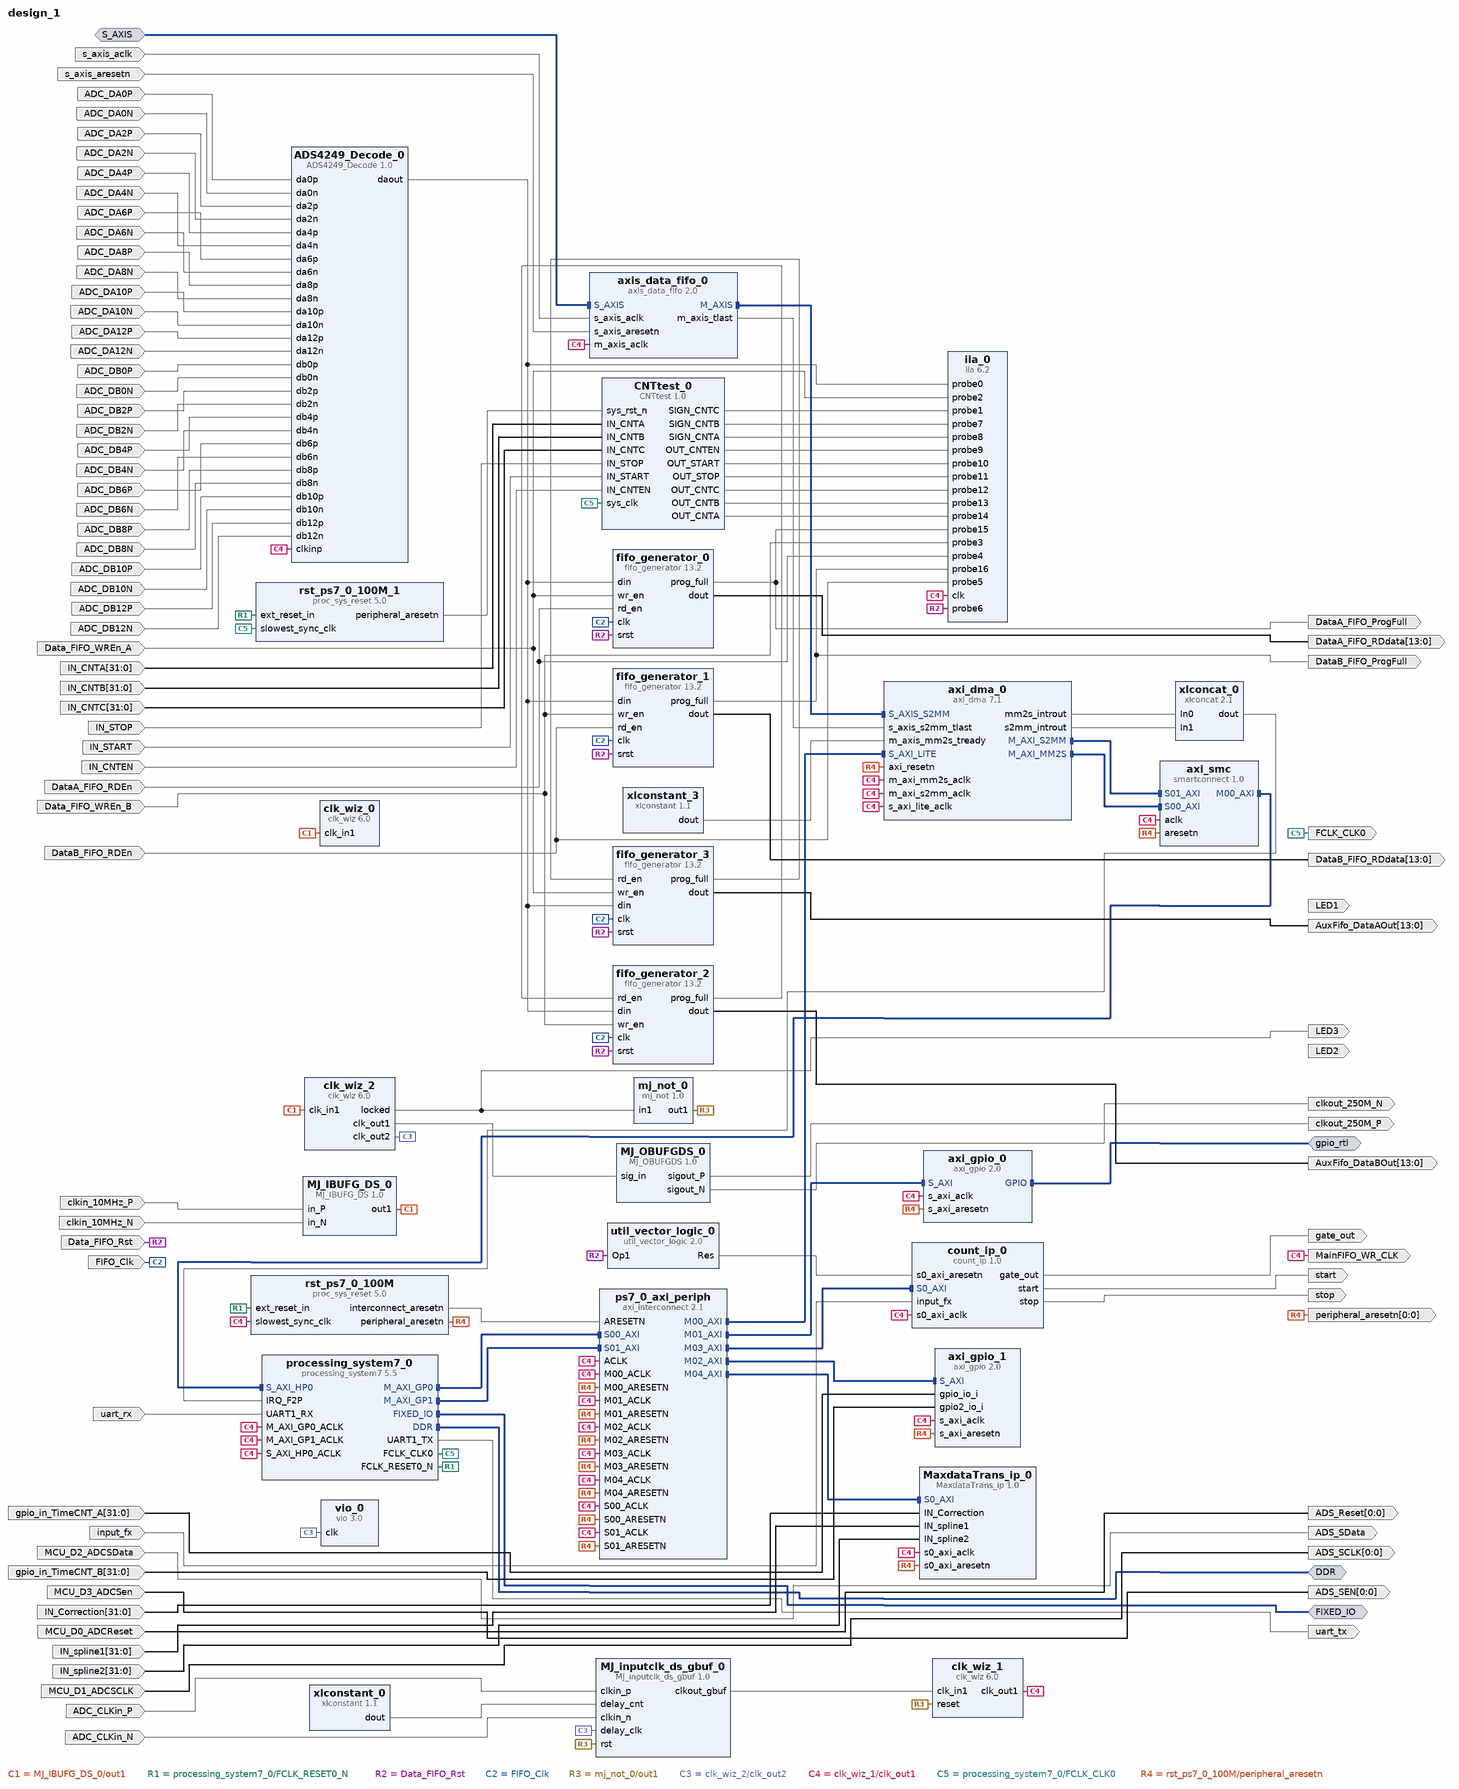
[diagram p0: block diagram of the top level]
# Vivado block design design_1, xc7z030ffg676-2, Vivado 2020.2
create_bd_design design_1

create_bd_intf_port -mode Master -vlnv xilinx.com:interface:ddrx_rtl:1.0 DDR
create_bd_intf_port -mode Master -vlnv xilinx.com:display_processing_system7:fixedio_rtl:1.0 FIXED_IO
create_bd_intf_port -mode Slave -vlnv xilinx.com:interface:axis_rtl:1.0 S_AXIS
set_property -dict [list \
  CONFIG.HAS_TKEEP 1 \
  CONFIG.HAS_TLAST 1 \
  CONFIG.HAS_TREADY 1 \
  CONFIG.HAS_TSTRB 0 \
  CONFIG.LAYERED_METADATA undef \
  CONFIG.TDATA_NUM_BYTES 4 \
  CONFIG.TDEST_WIDTH 0 \
  CONFIG.TID_WIDTH 0 \
  CONFIG.TUSER_WIDTH 0 \
] [get_bd_intf_ports S_AXIS]
create_bd_intf_port -mode Master -vlnv xilinx.com:interface:gpio_rtl:1.0 gpio_rtl
create_bd_port -dir O LED2
create_bd_port -dir O LED1
create_bd_port -dir I MCU_D2_ADCSData
create_bd_port -dir O ADS_SData
create_bd_port -dir O clkout_250M_P
create_bd_port -dir O clkout_250M_N
create_bd_port -dir I -type clk clkin_10MHz_P
set_property -dict {CONFIG.FREQ_HZ 98304000} [get_bd_ports clkin_10MHz_P]
create_bd_port -dir I -type clk clkin_10MHz_N
set_property -dict {CONFIG.FREQ_HZ 98304000} [get_bd_ports clkin_10MHz_N]
create_bd_port -dir I ADC_DA0P
create_bd_port -dir I ADC_DA0N
create_bd_port -dir I ADC_DA2P
create_bd_port -dir I ADC_DA2N
create_bd_port -dir I ADC_DA4P
create_bd_port -dir I ADC_DA4N
create_bd_port -dir I ADC_DA6P
create_bd_port -dir I ADC_DA6N
create_bd_port -dir I ADC_DA8P
create_bd_port -dir I ADC_DA8N
create_bd_port -dir I ADC_DA10P
create_bd_port -dir I ADC_DA10N
create_bd_port -dir I ADC_DA12P
create_bd_port -dir I ADC_DA12N
create_bd_port -dir I ADC_DB0P
create_bd_port -dir I ADC_DB0N
create_bd_port -dir I ADC_DB2P
create_bd_port -dir I ADC_DB2N
create_bd_port -dir I ADC_DB4P
create_bd_port -dir I ADC_DB4N
create_bd_port -dir I ADC_DB6P
create_bd_port -dir I ADC_DB6N
create_bd_port -dir I ADC_DB8P
create_bd_port -dir I ADC_DB8N
create_bd_port -dir I ADC_DB10P
create_bd_port -dir I ADC_DB10N
create_bd_port -dir I ADC_DB12P
create_bd_port -dir I ADC_DB12N
create_bd_port -dir I MCU_D3_ADCSen
create_bd_port -dir O -from 0 -to 0 ADS_SEN
create_bd_port -dir I MCU_D0_ADCReset
create_bd_port -dir O -from 0 -to 0 ADS_Reset
create_bd_port -dir I MCU_D1_ADCSCLK
create_bd_port -dir O -from 0 -to 0 ADS_SCLK
create_bd_port -dir O uart_tx
create_bd_port -dir I -type clk s_axis_aclk
create_bd_port -dir I -type rst s_axis_aresetn
create_bd_port -dir I uart_rx
create_bd_port -dir O LED3
create_bd_port -dir O -from 13 -to 0 DataA_FIFO_RDdata
create_bd_port -dir I -type rst Data_FIFO_Rst
set_property -dict {CONFIG.POLARITY ACTIVE_HIGH} [get_bd_ports Data_FIFO_Rst]
create_bd_port -dir I Data_FIFO_WREn_A
create_bd_port -dir O -from 13 -to 0 DataB_FIFO_RDdata
create_bd_port -dir O -from 13 -to 0 -type data AuxFifo_DataBOut
create_bd_port -dir O -from 13 -to 0 -type data AuxFifo_DataAOut
create_bd_port -dir I -from 31 -to 0 -type data gpio_in_TimeCNT_A
create_bd_port -dir I -from 31 -to 0 -type data gpio_in_TimeCNT_B
create_bd_port -dir I Data_FIFO_WREn_B
create_bd_port -dir I -type clk FIFO_Clk
set_property -dict {CONFIG.FREQ_HZ 250000000} [get_bd_ports FIFO_Clk]
create_bd_port -dir O DataA_FIFO_ProgFull
create_bd_port -dir I ADC_CLKin_P
create_bd_port -dir I ADC_CLKin_N
create_bd_port -dir O -type clk MainFIFO_WR_CLK
create_bd_port -dir I DataA_FIFO_RDEn
create_bd_port -dir O DataB_FIFO_ProgFull
create_bd_port -dir I DataB_FIFO_RDEn
create_bd_port -dir O -type clk FCLK_CLK0
create_bd_port -dir I input_fx
create_bd_port -dir O gate_out
create_bd_port -dir O stop
create_bd_port -dir O start
create_bd_port -dir O -from 0 -to 0 -type rst peripheral_aresetn
create_bd_port -dir I -from 31 -to 0 IN_CNTA
create_bd_port -dir I -from 31 -to 0 IN_CNTB
create_bd_port -dir I -from 31 -to 0 IN_CNTC
create_bd_port -dir I IN_STOP
create_bd_port -dir I IN_START
create_bd_port -dir I IN_CNTEN
create_bd_port -dir I -from 31 -to 0 IN_Correction
create_bd_port -dir I -from 31 -to 0 IN_spline1
create_bd_port -dir I -from 31 -to 0 IN_spline2

create_bd_cell -type ip -vlnv xilinx.com:user:MJ_OBUFGDS:1.0 MJ_OBUFGDS_0
create_bd_cell -type ip -vlnv xilinx.com:user:MJ_IBUFG_DS:1.0 MJ_IBUFG_DS_0
create_bd_cell -type ip -vlnv xilinx.com:user:ADS4249_Decode:1.0 ADS4249_Decode_0
create_bd_cell -type ip -vlnv xilinx.com:ip:processing_system7:5.5 processing_system7_0
set_property -dict [list \
  CONFIG.PCW_APU_PERIPHERAL_FREQMHZ 666.666666 \
  CONFIG.PCW_CPU_CPU_6X4X_MAX_RANGE 800 \
  CONFIG.PCW_ENET0_ENET0_IO {MIO 16 .. 27} \
  CONFIG.PCW_ENET0_GRP_MDIO_ENABLE 1 \
  CONFIG.PCW_ENET0_GRP_MDIO_IO {MIO 52 .. 53} \
  CONFIG.PCW_ENET0_PERIPHERAL_ENABLE 1 \
  CONFIG.PCW_FPGA0_PERIPHERAL_FREQMHZ 100 \
  CONFIG.PCW_FPGA1_PERIPHERAL_FREQMHZ 50 \
  CONFIG.PCW_GPIO_MIO_GPIO_ENABLE 0 \
  CONFIG.PCW_IRQ_F2P_INTR 1 \
  CONFIG.PCW_PERIPHERAL_BOARD_PRESET None \
  CONFIG.PCW_PRESET_BANK1_VOLTAGE {LVCMOS 1.8V} \
  CONFIG.PCW_QSPI_GRP_FBCLK_ENABLE 1 \
  CONFIG.PCW_QSPI_GRP_FBCLK_IO {MIO 8} \
  CONFIG.PCW_QSPI_GRP_SINGLE_SS_ENABLE 1 \
  CONFIG.PCW_QSPI_GRP_SINGLE_SS_IO {MIO 1 .. 6} \
  CONFIG.PCW_QSPI_PERIPHERAL_ENABLE 1 \
  CONFIG.PCW_QSPI_PERIPHERAL_FREQMHZ 125 \
  CONFIG.PCW_QSPI_QSPI_IO {MIO 1 .. 6} \
  CONFIG.PCW_SD0_GRP_CD_ENABLE 1 \
  CONFIG.PCW_SD0_GRP_CD_IO {MIO 47} \
  CONFIG.PCW_SD0_GRP_WP_ENABLE 0 \
  CONFIG.PCW_SD0_PERIPHERAL_ENABLE 1 \
  CONFIG.PCW_SD0_SD0_IO {MIO 40 .. 45} \
  CONFIG.PCW_SDIO_PERIPHERAL_FREQMHZ 100 \
  CONFIG.PCW_SINGLE_QSPI_DATA_MODE x4 \
  CONFIG.PCW_UART1_PERIPHERAL_ENABLE 1 \
  CONFIG.PCW_UART1_UART1_IO EMIO \
  CONFIG.PCW_UART_PERIPHERAL_FREQMHZ 100 \
  CONFIG.PCW_UIPARAM_DDR_FREQ_MHZ 533.333333 \
  CONFIG.PCW_UIPARAM_DDR_PARTNO {MT41K256M16 RE-125} \
  CONFIG.PCW_USB0_PERIPHERAL_ENABLE 0 \
  CONFIG.PCW_USE_FABRIC_INTERRUPT 1 \
  CONFIG.PCW_USE_M_AXI_GP1 1 \
  CONFIG.PCW_USE_S_AXI_HP0 1 \
] [get_bd_cells processing_system7_0]
# 431 more settings of processing_system7_0 are not shown: defaults, MIO pin electricals, DDR timing, and values the tool derives
create_bd_cell -type ip -vlnv xilinx.com:user:MJ_inputclk_ds_gbuf:1.0 MJ_inputclk_ds_gbuf_0
create_bd_cell -type ip -vlnv xilinx.com:user:mj_not:1.0 mj_not_0
create_bd_cell -type ip -vlnv xilinx.com:user:CNTtest:1.0 CNTtest_0
create_bd_cell -type ip -vlnv xilinx.com:user:count_ip:1.0 count_ip_0
create_bd_cell -type ip -vlnv xilinx.com:user:MaxdataTrans_ip:1.0 MaxdataTrans_ip_0
create_bd_cell -type ip -vlnv xilinx.com:ip:axi_dma:7.1 axi_dma_0
set_property -dict {CONFIG.c_include_sg 0 CONFIG.c_sg_length_width 23} [get_bd_cells axi_dma_0]
create_bd_cell -type ip -vlnv xilinx.com:ip:axi_gpio:2.0 axi_gpio_0
set_property -dict {CONFIG.C_ALL_OUTPUTS 0 CONFIG.C_GPIO_WIDTH 8} [get_bd_cells axi_gpio_0]
create_bd_cell -type ip -vlnv xilinx.com:ip:axi_gpio:2.0 axi_gpio_1
set_property -dict [list \
  CONFIG.C_ALL_INPUTS 1 \
  CONFIG.C_ALL_INPUTS_2 1 \
  CONFIG.C_GPIO_WIDTH 32 \
  CONFIG.C_IS_DUAL 1 \
] [get_bd_cells axi_gpio_1]
create_bd_cell -type ip -vlnv xilinx.com:ip:smartconnect:1.0 axi_smc
set_property -dict {CONFIG.NUM_SI 2} [get_bd_cells axi_smc]
create_bd_cell -type ip -vlnv xilinx.com:ip:axis_data_fifo:2.0 axis_data_fifo_0
set_property -dict [list \
  CONFIG.FIFO_DEPTH 1024 \
  CONFIG.HAS_RD_DATA_COUNT 1 \
  CONFIG.HAS_WR_DATA_COUNT 1 \
  CONFIG.IS_ACLK_ASYNC 1 \
  CONFIG.SYNCHRONIZATION_STAGES 2 \
] [get_bd_cells axis_data_fifo_0]
create_bd_cell -type ip -vlnv xilinx.com:ip:clk_wiz:6.0 clk_wiz_0
set_property -dict [list \
  CONFIG.CLKIN1_JITTER_PS 10 \
  CONFIG.CLKIN1_UI_JITTER 10 \
  CONFIG.CLKIN2_JITTER_PS 100.000 \
  CONFIG.CLKIN2_UI_JITTER 100.000 \
  CONFIG.CLKOUT1_DRIVES BUFG \
  CONFIG.CLKOUT1_JITTER 118.932 \
  CONFIG.CLKOUT1_PHASE_ERROR 230.564 \
  CONFIG.CLKOUT1_REQUESTED_OUT_FREQ 250 \
  CONFIG.CLKOUT2_DRIVES BUFG \
  CONFIG.CLKOUT2_JITTER 148.965 \
  CONFIG.CLKOUT2_PHASE_ERROR 230.564 \
  CONFIG.CLKOUT2_REQUESTED_OUT_FREQ 50 \
  CONFIG.CLKOUT2_USED true \
  CONFIG.CLKOUT3_DRIVES BUFG \
  CONFIG.CLKOUT3_REQUESTED_OUT_FREQ 100.000 \
  CONFIG.CLKOUT4_DRIVES BUFG \
  CONFIG.CLKOUT4_REQUESTED_OUT_FREQ 100.000 \
  CONFIG.CLKOUT5_DRIVES BUFG \
  CONFIG.CLKOUT5_REQUESTED_OUT_FREQ 100.000 \
  CONFIG.CLKOUT6_DRIVES BUFG \
  CONFIG.CLKOUT6_REQUESTED_OUT_FREQ 100.000 \
  CONFIG.CLKOUT7_DRIVES BUFG \
  CONFIG.CLKOUT7_REQUESTED_OUT_FREQ 100.000 \
  CONFIG.FEEDBACK_SOURCE FDBK_AUTO \
  CONFIG.JITTER_OPTIONS PS \
  CONFIG.JITTER_SEL Min_O_Jitter \
  CONFIG.MMCM_BANDWIDTH HIGH \
  CONFIG.MMCM_CLKFBOUT_MULT_F 61 \
  CONFIG.MMCM_CLKIN1_PERIOD 10.172 \
  CONFIG.MMCM_CLKIN2_PERIOD 10.000 \
  CONFIG.MMCM_CLKOUT0_DIVIDE_F 6 \
  CONFIG.MMCM_CLKOUT1_DIVIDE 30 \
  CONFIG.MMCM_COMPENSATION ZHOLD \
  CONFIG.MMCM_DIVCLK_DIVIDE 4 \
  CONFIG.MMCM_REF_JITTER1 0.001 \
  CONFIG.MMCM_REF_JITTER2 0.010 \
  CONFIG.NUM_OUT_CLKS 2 \
  CONFIG.OVERRIDE_MMCM false \
  CONFIG.PRIMITIVE PLL \
  CONFIG.PRIM_IN_FREQ 98.304 \
  CONFIG.PRIM_SOURCE Global_buffer \
  CONFIG.USE_CLOCK_SEQUENCING false \
  CONFIG.USE_FREQ_SYNTH true \
  CONFIG.USE_RESET false \
  CONFIG.USE_SAFE_CLOCK_STARTUP false \
] [get_bd_cells clk_wiz_0]
create_bd_cell -type ip -vlnv xilinx.com:ip:clk_wiz:6.0 clk_wiz_2
set_property -dict [list \
  CONFIG.CLKIN1_JITTER_PS 10 \
  CONFIG.CLKIN1_UI_JITTER 10 \
  CONFIG.CLKIN2_JITTER_PS 100.000 \
  CONFIG.CLKIN2_UI_JITTER 100.000 \
  CONFIG.CLKOUT1_DRIVES BUFG \
  CONFIG.CLKOUT1_JITTER 73.135 \
  CONFIG.CLKOUT1_PHASE_ERROR 65.553 \
  CONFIG.CLKOUT1_REQUESTED_OUT_FREQ 200 \
  CONFIG.CLKOUT2_DRIVES BUFG \
  CONFIG.CLKOUT2_JITTER 95.295 \
  CONFIG.CLKOUT2_PHASE_ERROR 65.553 \
  CONFIG.CLKOUT2_REQUESTED_OUT_FREQ 50 \
  CONFIG.CLKOUT2_USED true \
  CONFIG.CLKOUT3_DRIVES BUFG \
  CONFIG.CLKOUT3_REQUESTED_OUT_FREQ 100.000 \
  CONFIG.CLKOUT4_DRIVES BUFG \
  CONFIG.CLKOUT4_REQUESTED_OUT_FREQ 100.000 \
  CONFIG.CLKOUT5_DRIVES BUFG \
  CONFIG.CLKOUT5_REQUESTED_OUT_FREQ 100.000 \
  CONFIG.CLKOUT6_DRIVES BUFG \
  CONFIG.CLKOUT6_REQUESTED_OUT_FREQ 100.000 \
  CONFIG.CLKOUT7_DRIVES BUFG \
  CONFIG.CLKOUT7_REQUESTED_OUT_FREQ 100.000 \
  CONFIG.FEEDBACK_SOURCE FDBK_AUTO \
  CONFIG.JITTER_OPTIONS PS \
  CONFIG.JITTER_SEL Min_O_Jitter \
  CONFIG.MMCM_BANDWIDTH HIGH \
  CONFIG.MMCM_CLKFBOUT_MULT_F 9 \
  CONFIG.MMCM_CLKIN1_PERIOD 5.000 \
  CONFIG.MMCM_CLKIN2_PERIOD 10.000 \
  CONFIG.MMCM_CLKOUT0_DIVIDE_F 9 \
  CONFIG.MMCM_CLKOUT1_DIVIDE 36 \
  CONFIG.MMCM_COMPENSATION ZHOLD \
  CONFIG.MMCM_DIVCLK_DIVIDE 1 \
  CONFIG.MMCM_REF_JITTER1 0.002 \
  CONFIG.MMCM_REF_JITTER2 0.010 \
  CONFIG.NUM_OUT_CLKS 2 \
  CONFIG.OVERRIDE_MMCM false \
  CONFIG.PRIMITIVE PLL \
  CONFIG.PRIM_IN_FREQ 200 \
  CONFIG.PRIM_SOURCE Global_buffer \
  CONFIG.USE_CLOCK_SEQUENCING false \
  CONFIG.USE_FREQ_SYNTH true \
  CONFIG.USE_RESET true \
  CONFIG.USE_SAFE_CLOCK_STARTUP false \
] [get_bd_cells clk_wiz_2]
create_bd_cell -type ip -vlnv xilinx.com:ip:clk_wiz:6.0 clk_wiz_1
set_property -dict [list \
  CONFIG.CLKIN1_JITTER_PS 400.0 \
  CONFIG.CLKIN1_UI_JITTER 0.10 \
  CONFIG.CLKOUT1_DRIVES BUFG \
  CONFIG.CLKOUT1_JITTER 100.428 \
  CONFIG.CLKOUT1_PHASE_ERROR 66.982 \
  CONFIG.CLKOUT1_REQUESTED_OUT_FREQ 250 \
  CONFIG.CLKOUT2_DRIVES BUFG \
  CONFIG.CLKOUT3_DRIVES BUFG \
  CONFIG.CLKOUT4_DRIVES BUFG \
  CONFIG.CLKOUT5_DRIVES BUFG \
  CONFIG.CLKOUT6_DRIVES BUFG \
  CONFIG.CLKOUT7_DRIVES BUFG \
  CONFIG.JITTER_SEL Min_O_Jitter \
  CONFIG.MMCM_BANDWIDTH HIGH \
  CONFIG.MMCM_CLKFBOUT_MULT_F 7 \
  CONFIG.MMCM_CLKIN1_PERIOD 4.000 \
  CONFIG.MMCM_CLKIN2_PERIOD 10.0 \
  CONFIG.MMCM_CLKOUT0_DIVIDE_F 7 \
  CONFIG.MMCM_COMPENSATION ZHOLD \
  CONFIG.MMCM_DIVCLK_DIVIDE 1 \
  CONFIG.MMCM_REF_JITTER1 0.100 \
  CONFIG.PRIMITIVE PLL \
  CONFIG.PRIM_IN_FREQ 250 \
  CONFIG.PRIM_SOURCE No_buffer \
  CONFIG.USE_LOCKED false \
] [get_bd_cells clk_wiz_1]
create_bd_cell -type ip -vlnv xilinx.com:ip:fifo_generator:13.2 fifo_generator_0
set_property -dict [list \
  CONFIG.Data_Count false \
  CONFIG.Fifo_Implementation Common_Clock_Block_RAM \
  CONFIG.Full_Threshold_Assert_Value 1022 \
  CONFIG.Input_Data_Width 14 \
  CONFIG.Input_Depth 1024 \
  CONFIG.Output_Data_Width 14 \
  CONFIG.Programmable_Full_Type Single_Programmable_Full_Threshold_Constant \
  CONFIG.Reset_Type Synchronous_Reset \
  CONFIG.Use_Dout_Reset true \
] [get_bd_cells fifo_generator_0]
create_bd_cell -type ip -vlnv xilinx.com:ip:fifo_generator:13.2 fifo_generator_1
set_property -dict [list \
  CONFIG.Data_Count false \
  CONFIG.Fifo_Implementation Common_Clock_Block_RAM \
  CONFIG.Full_Threshold_Assert_Value 1022 \
  CONFIG.Input_Data_Width 14 \
  CONFIG.Input_Depth 1024 \
  CONFIG.Output_Data_Width 14 \
  CONFIG.Programmable_Full_Type Single_Programmable_Full_Threshold_Constant \
  CONFIG.Reset_Type Synchronous_Reset \
  CONFIG.Use_Dout_Reset true \
] [get_bd_cells fifo_generator_1]
create_bd_cell -type ip -vlnv xilinx.com:ip:fifo_generator:13.2 fifo_generator_2
set_property -dict [list \
  CONFIG.Almost_Full_Flag false \
  CONFIG.Full_Threshold_Assert_Value 254 \
  CONFIG.Input_Data_Width 14 \
  CONFIG.Input_Depth 256 \
  CONFIG.Output_Data_Width 14 \
  CONFIG.Programmable_Empty_Type No_Programmable_Empty_Threshold \
  CONFIG.Programmable_Full_Type Single_Programmable_Full_Threshold_Constant \
] [get_bd_cells fifo_generator_2]
create_bd_cell -type ip -vlnv xilinx.com:ip:fifo_generator:13.2 fifo_generator_3
set_property -dict [list \
  CONFIG.Full_Threshold_Assert_Value 254 \
  CONFIG.Input_Data_Width 14 \
  CONFIG.Input_Depth 256 \
  CONFIG.Output_Data_Width 14 \
  CONFIG.Programmable_Empty_Type No_Programmable_Empty_Threshold \
  CONFIG.Programmable_Full_Type Single_Programmable_Full_Threshold_Constant \
] [get_bd_cells fifo_generator_3]
create_bd_cell -type ip -vlnv xilinx.com:ip:ila:6.2 ila_0
set_property -dict [list \
  CONFIG.C_DATA_DEPTH 8192 \
  CONFIG.C_ENABLE_ILA_AXI_MON false \
  CONFIG.C_MONITOR_TYPE Native \
  CONFIG.C_NUM_OF_PROBES 17 \
  CONFIG.C_PROBE0_WIDTH 14 \
  CONFIG.C_PROBE12_WIDTH 32 \
  CONFIG.C_PROBE13_WIDTH 32 \
  CONFIG.C_PROBE14_WIDTH 32 \
  CONFIG.C_PROBE1_WIDTH 1 \
] [get_bd_cells ila_0]
create_bd_cell -type ip -vlnv xilinx.com:ip:axi_interconnect:2.1 ps7_0_axi_periph
set_property -dict [list \
  CONFIG.NUM_MI 5 \
  CONFIG.NUM_SI 2 \
  CONFIG.S00_HAS_DATA_FIFO 2 \
  CONFIG.S01_HAS_DATA_FIFO 2 \
  CONFIG.STRATEGY 2 \
] [get_bd_cells ps7_0_axi_periph]
create_bd_cell -type ip -vlnv xilinx.com:ip:proc_sys_reset:5.0 rst_ps7_0_100M
create_bd_cell -type ip -vlnv xilinx.com:ip:proc_sys_reset:5.0 rst_ps7_0_100M_1
create_bd_cell -type ip -vlnv xilinx.com:ip:util_vector_logic:2.0 util_vector_logic_0
set_property -dict {CONFIG.C_OPERATION not CONFIG.C_SIZE 1} [get_bd_cells util_vector_logic_0]
create_bd_cell -type ip -vlnv xilinx.com:ip:vio:3.0 vio_0
set_property -dict {CONFIG.C_NUM_PROBE_IN 0 CONFIG.C_PROBE_OUT0_INIT_VAL 0x03 CONFIG.C_PROBE_OUT0_WIDTH 5} [get_bd_cells vio_0]
create_bd_cell -type ip -vlnv xilinx.com:ip:xlconcat:2.1 xlconcat_0
create_bd_cell -type ip -vlnv xilinx.com:ip:xlconstant:1.1 xlconstant_0
set_property -dict {CONFIG.CONST_VAL 3 CONFIG.CONST_WIDTH 5} [get_bd_cells xlconstant_0]
create_bd_cell -type ip -vlnv xilinx.com:ip:xlconstant:1.1 xlconstant_3

# ---- connections ----

connect_bd_intf_net [get_bd_intf_pins axi_smc/M00_AXI] [get_bd_intf_pins processing_system7_0/S_AXI_HP0]
connect_bd_intf_net [get_bd_intf_pins axi_dma_0/M_AXI_S2MM] [get_bd_intf_pins axi_smc/S01_AXI]
connect_bd_intf_net [get_bd_intf_pins axis_data_fifo_0/M_AXIS] [get_bd_intf_pins axi_dma_0/S_AXIS_S2MM]
connect_bd_intf_net [get_bd_intf_pins processing_system7_0/M_AXI_GP0] [get_bd_intf_pins ps7_0_axi_periph/S00_AXI]
connect_bd_intf_net [get_bd_intf_pins axi_dma_0/M_AXI_MM2S] [get_bd_intf_pins axi_smc/S00_AXI]
connect_bd_intf_net [get_bd_intf_pins ps7_0_axi_periph/M01_AXI] [get_bd_intf_pins axi_gpio_0/S_AXI]
connect_bd_intf_net [get_bd_intf_pins ps7_0_axi_periph/M02_AXI] [get_bd_intf_pins axi_gpio_1/S_AXI]
connect_bd_intf_net [get_bd_intf_pins ps7_0_axi_periph/M00_AXI] [get_bd_intf_pins axi_dma_0/S_AXI_LITE]
connect_bd_intf_net [get_bd_intf_pins processing_system7_0/M_AXI_GP1] [get_bd_intf_pins ps7_0_axi_periph/S01_AXI]
connect_bd_intf_net [get_bd_intf_pins ps7_0_axi_periph/M03_AXI] [get_bd_intf_pins count_ip_0/S0_AXI]
connect_bd_intf_net [get_bd_intf_pins ps7_0_axi_periph/M04_AXI] [get_bd_intf_pins MaxdataTrans_ip_0/S0_AXI]
connect_bd_intf_net [get_bd_intf_ports FIXED_IO] [get_bd_intf_pins processing_system7_0/FIXED_IO]
connect_bd_intf_net -intf_net S_AXIS_0_1 [get_bd_intf_ports S_AXIS] [get_bd_intf_pins axis_data_fifo_0/S_AXIS]
connect_bd_intf_net [get_bd_intf_ports DDR] [get_bd_intf_pins processing_system7_0/DDR]
connect_bd_intf_net [get_bd_intf_ports gpio_rtl] [get_bd_intf_pins axi_gpio_0/GPIO]
connect_bd_net [get_bd_ports MCU_D2_ADCSData] [get_bd_ports ADS_SData]
connect_bd_net [get_bd_pins MJ_IBUFG_DS_0/out1] [get_bd_pins clk_wiz_0/clk_in1] [get_bd_pins clk_wiz_2/clk_in1]
connect_bd_net [get_bd_pins MJ_OBUFGDS_0/sigout_P] [get_bd_ports clkout_250M_P]
connect_bd_net [get_bd_pins MJ_OBUFGDS_0/sigout_N] [get_bd_ports clkout_250M_N]
connect_bd_net [get_bd_ports clkin_10MHz_P] [get_bd_pins MJ_IBUFG_DS_0/in_P]
connect_bd_net [get_bd_ports clkin_10MHz_N] [get_bd_pins MJ_IBUFG_DS_0/in_N]
connect_bd_net [get_bd_ports ADC_DA0P] [get_bd_pins ADS4249_Decode_0/da0p]
connect_bd_net [get_bd_ports ADC_DA0N] [get_bd_pins ADS4249_Decode_0/da0n]
connect_bd_net [get_bd_ports ADC_DA2P] [get_bd_pins ADS4249_Decode_0/da2p]
connect_bd_net [get_bd_ports ADC_DA2N] [get_bd_pins ADS4249_Decode_0/da2n]
connect_bd_net [get_bd_ports ADC_DA4P] [get_bd_pins ADS4249_Decode_0/da4p]
connect_bd_net [get_bd_ports ADC_DA4N] [get_bd_pins ADS4249_Decode_0/da4n]
connect_bd_net [get_bd_ports ADC_DA6P] [get_bd_pins ADS4249_Decode_0/da6p]
connect_bd_net [get_bd_ports ADC_DA6N] [get_bd_pins ADS4249_Decode_0/da6n]
connect_bd_net [get_bd_ports ADC_DA8P] [get_bd_pins ADS4249_Decode_0/da8p]
connect_bd_net [get_bd_ports ADC_DA8N] [get_bd_pins ADS4249_Decode_0/da8n]
connect_bd_net [get_bd_ports ADC_DA10P] [get_bd_pins ADS4249_Decode_0/da10p]
connect_bd_net [get_bd_ports ADC_DA10N] [get_bd_pins ADS4249_Decode_0/da10n]
connect_bd_net [get_bd_ports ADC_DA12P] [get_bd_pins ADS4249_Decode_0/da12p]
connect_bd_net [get_bd_ports ADC_DA12N] [get_bd_pins ADS4249_Decode_0/da12n]
connect_bd_net [get_bd_ports ADC_DB0P] [get_bd_pins ADS4249_Decode_0/db0p]
connect_bd_net [get_bd_ports ADC_DB0N] [get_bd_pins ADS4249_Decode_0/db0n]
connect_bd_net [get_bd_ports ADC_DB2P] [get_bd_pins ADS4249_Decode_0/db2p]
connect_bd_net [get_bd_ports ADC_DB2N] [get_bd_pins ADS4249_Decode_0/db2n]
connect_bd_net [get_bd_ports ADC_DB4P] [get_bd_pins ADS4249_Decode_0/db4p]
connect_bd_net [get_bd_ports ADC_DB4N] [get_bd_pins ADS4249_Decode_0/db4n]
connect_bd_net [get_bd_ports ADC_DB6P] [get_bd_pins ADS4249_Decode_0/db6p]
connect_bd_net [get_bd_ports ADC_DB6N] [get_bd_pins ADS4249_Decode_0/db6n]
connect_bd_net [get_bd_ports ADC_DB8P] [get_bd_pins ADS4249_Decode_0/db8p]
connect_bd_net [get_bd_ports ADC_DB8N] [get_bd_pins ADS4249_Decode_0/db8n]
connect_bd_net [get_bd_ports ADC_DB10P] [get_bd_pins ADS4249_Decode_0/db10p]
connect_bd_net [get_bd_ports ADC_DB10N] [get_bd_pins ADS4249_Decode_0/db10n]
connect_bd_net [get_bd_ports ADC_DB12P] [get_bd_pins ADS4249_Decode_0/db12p]
connect_bd_net [get_bd_ports ADC_DB12N] [get_bd_pins ADS4249_Decode_0/db12n]
connect_bd_net -net ADS4249_Decode_0_daout [get_bd_pins ADS4249_Decode_0/daout] \
  [get_bd_pins fifo_generator_0/din] [get_bd_pins fifo_generator_1/din] [get_bd_pins fifo_generator_2/din] \
  [get_bd_pins fifo_generator_3/din] [get_bd_pins ila_0/probe0]
connect_bd_net [get_bd_ports MCU_D3_ADCSen] [get_bd_ports ADS_SEN]
connect_bd_net [get_bd_ports MCU_D0_ADCReset] [get_bd_ports ADS_Reset]
connect_bd_net [get_bd_ports MCU_D1_ADCSCLK] [get_bd_ports ADS_SCLK]
connect_bd_net [get_bd_pins axi_dma_0/mm2s_introut] [get_bd_pins xlconcat_0/In0]
connect_bd_net [get_bd_pins axi_dma_0/s2mm_introut] [get_bd_pins xlconcat_0/In1]
connect_bd_net [get_bd_pins axis_data_fifo_0/m_axis_tlast] [get_bd_pins axi_dma_0/s_axis_s2mm_tlast]
connect_bd_net [get_bd_pins processing_system7_0/FCLK_RESET0_N] [get_bd_pins rst_ps7_0_100M/ext_reset_in] [get_bd_pins rst_ps7_0_100M_1/ext_reset_in]
connect_bd_net [get_bd_pins processing_system7_0/UART1_TX] [get_bd_ports uart_tx]
connect_bd_net [get_bd_pins rst_ps7_0_100M/interconnect_aresetn] [get_bd_pins ps7_0_axi_periph/ARESETN]
connect_bd_net -net s_axis_aclk_0_1 [get_bd_ports s_axis_aclk] [get_bd_pins axis_data_fifo_0/s_axis_aclk]
connect_bd_net -net s_axis_aresetn_0_1 [get_bd_ports s_axis_aresetn] [get_bd_pins axis_data_fifo_0/s_axis_aresetn]
connect_bd_net [get_bd_ports uart_rx] [get_bd_pins processing_system7_0/UART1_RX]
connect_bd_net [get_bd_pins xlconcat_0/dout] [get_bd_pins processing_system7_0/IRQ_F2P]
connect_bd_net -net xlconstant_0_dout [get_bd_pins xlconstant_3/dout] [get_bd_pins axi_dma_0/m_axis_mm2s_tready]
connect_bd_net -net clk_wiz_0_locked [get_bd_pins clk_wiz_2/locked] [get_bd_ports LED3] [get_bd_pins mj_not_0/in1]
connect_bd_net [get_bd_pins fifo_generator_0/dout] [get_bd_ports DataA_FIFO_RDdata]
connect_bd_net [get_bd_ports Data_FIFO_Rst] \
  [get_bd_pins fifo_generator_0/srst] [get_bd_pins fifo_generator_1/srst] [get_bd_pins fifo_generator_2/srst] \
  [get_bd_pins fifo_generator_3/srst] [get_bd_pins ila_0/probe6] [get_bd_pins util_vector_logic_0/Op1]
connect_bd_net -net Data_FIFO_WREn_1 [get_bd_ports Data_FIFO_WREn_A] \
  [get_bd_pins fifo_generator_0/wr_en] [get_bd_pins fifo_generator_3/wr_en] [get_bd_pins ila_0/probe2]
connect_bd_net [get_bd_pins fifo_generator_1/dout] [get_bd_ports DataB_FIFO_RDdata]
connect_bd_net [get_bd_pins fifo_generator_2/dout] [get_bd_ports AuxFifo_DataBOut]
connect_bd_net [get_bd_pins fifo_generator_3/dout] [get_bd_ports AuxFifo_DataAOut]
connect_bd_net [get_bd_ports gpio_in_TimeCNT_A] [get_bd_pins axi_gpio_1/gpio_io_i]
connect_bd_net [get_bd_ports gpio_in_TimeCNT_B] [get_bd_pins axi_gpio_1/gpio2_io_i]
connect_bd_net [get_bd_ports Data_FIFO_WREn_B] [get_bd_pins fifo_generator_1/wr_en] [get_bd_pins fifo_generator_2/wr_en] [get_bd_pins ila_0/probe3]
connect_bd_net [get_bd_ports FIFO_Clk] \
  [get_bd_pins fifo_generator_0/clk] [get_bd_pins fifo_generator_1/clk] [get_bd_pins fifo_generator_2/clk] \
  [get_bd_pins fifo_generator_3/clk]
connect_bd_net [get_bd_pins fifo_generator_2/prog_full] [get_bd_pins fifo_generator_2/rd_en]
connect_bd_net [get_bd_pins fifo_generator_3/prog_full] [get_bd_pins fifo_generator_3/rd_en]
connect_bd_net [get_bd_pins fifo_generator_0/prog_full] [get_bd_ports DataA_FIFO_ProgFull] [get_bd_pins ila_0/probe15]
connect_bd_net [get_bd_ports ADC_CLKin_P] [get_bd_pins MJ_inputclk_ds_gbuf_0/clkin_p]
connect_bd_net [get_bd_ports ADC_CLKin_N] [get_bd_pins MJ_inputclk_ds_gbuf_0/clkin_n]
connect_bd_net [get_bd_pins mj_not_0/out1] [get_bd_pins MJ_inputclk_ds_gbuf_0/rst] [get_bd_pins clk_wiz_1/reset]
connect_bd_net -net clk_wiz_0_clk_out2 [get_bd_pins clk_wiz_2/clk_out2] [get_bd_pins MJ_inputclk_ds_gbuf_0/delay_clk] [get_bd_pins vio_0/clk]
connect_bd_net [get_bd_pins MJ_inputclk_ds_gbuf_0/clkout_gbuf] [get_bd_pins clk_wiz_1/clk_in1]
connect_bd_net [get_bd_pins clk_wiz_1/clk_out1] \
  [get_bd_ports MainFIFO_WR_CLK] [get_bd_pins ADS4249_Decode_0/clkinp] [get_bd_pins processing_system7_0/M_AXI_GP0_ACLK] \
  [get_bd_pins processing_system7_0/S_AXI_HP0_ACLK] [get_bd_pins processing_system7_0/M_AXI_GP1_ACLK] \
  [get_bd_pins count_ip_0/s0_axi_aclk] [get_bd_pins MaxdataTrans_ip_0/s0_axi_aclk] [get_bd_pins axi_dma_0/s_axi_lite_aclk] \
  [get_bd_pins axi_dma_0/m_axi_mm2s_aclk] [get_bd_pins axi_dma_0/m_axi_s2mm_aclk] [get_bd_pins axi_gpio_0/s_axi_aclk] \
  [get_bd_pins axi_gpio_1/s_axi_aclk] [get_bd_pins axi_smc/aclk] [get_bd_pins axis_data_fifo_0/m_axis_aclk] \
  [get_bd_pins ila_0/clk] [get_bd_pins ps7_0_axi_periph/ACLK] [get_bd_pins ps7_0_axi_periph/S00_ACLK] \
  [get_bd_pins ps7_0_axi_periph/M00_ACLK] [get_bd_pins ps7_0_axi_periph/M01_ACLK] [get_bd_pins ps7_0_axi_periph/M02_ACLK] \
  [get_bd_pins ps7_0_axi_periph/S01_ACLK] [get_bd_pins ps7_0_axi_periph/M03_ACLK] [get_bd_pins ps7_0_axi_periph/M04_ACLK] \
  [get_bd_pins rst_ps7_0_100M/slowest_sync_clk]
connect_bd_net [get_bd_ports DataA_FIFO_RDEn] [get_bd_pins fifo_generator_0/rd_en] [get_bd_pins ila_0/probe4]
connect_bd_net [get_bd_pins fifo_generator_1/prog_full] [get_bd_ports DataB_FIFO_ProgFull] [get_bd_pins ila_0/probe16]
connect_bd_net [get_bd_ports DataB_FIFO_RDEn] [get_bd_pins fifo_generator_1/rd_en] [get_bd_pins ila_0/probe5]
connect_bd_net [get_bd_pins processing_system7_0/FCLK_CLK0] \
  [get_bd_ports FCLK_CLK0] [get_bd_pins CNTtest_0/sys_clk] [get_bd_pins rst_ps7_0_100M_1/slowest_sync_clk]
connect_bd_net [get_bd_pins xlconstant_0/dout] [get_bd_pins MJ_inputclk_ds_gbuf_0/delay_cnt]
connect_bd_net [get_bd_pins clk_wiz_2/clk_out1] [get_bd_pins MJ_OBUFGDS_0/sig_in]
connect_bd_net -net input_fx_0_1 [get_bd_ports input_fx] [get_bd_pins count_ip_0/input_fx]
connect_bd_net [get_bd_pins count_ip_0/gate_out] [get_bd_ports gate_out]
connect_bd_net [get_bd_pins count_ip_0/stop] [get_bd_ports stop]
connect_bd_net [get_bd_pins count_ip_0/start] [get_bd_ports start]
connect_bd_net [get_bd_pins rst_ps7_0_100M/peripheral_aresetn] \
  [get_bd_ports peripheral_aresetn] [get_bd_pins MaxdataTrans_ip_0/s0_axi_aresetn] [get_bd_pins axi_dma_0/axi_resetn] \
  [get_bd_pins axi_gpio_0/s_axi_aresetn] [get_bd_pins axi_gpio_1/s_axi_aresetn] [get_bd_pins axi_smc/aresetn] \
  [get_bd_pins ps7_0_axi_periph/S00_ARESETN] [get_bd_pins ps7_0_axi_periph/M00_ARESETN] \
  [get_bd_pins ps7_0_axi_periph/M01_ARESETN] [get_bd_pins ps7_0_axi_periph/M02_ARESETN] \
  [get_bd_pins ps7_0_axi_periph/S01_ARESETN] [get_bd_pins ps7_0_axi_periph/M03_ARESETN] \
  [get_bd_pins ps7_0_axi_periph/M04_ARESETN]
connect_bd_net -net IN_CNTA_0_1 [get_bd_ports IN_CNTA] [get_bd_pins CNTtest_0/IN_CNTA]
connect_bd_net -net IN_CNTB_0_1 [get_bd_ports IN_CNTB] [get_bd_pins CNTtest_0/IN_CNTB]
connect_bd_net -net IN_CNTC_0_1 [get_bd_ports IN_CNTC] [get_bd_pins CNTtest_0/IN_CNTC]
connect_bd_net -net IN_STOP_0_1 [get_bd_ports IN_STOP] [get_bd_pins CNTtest_0/IN_STOP]
connect_bd_net -net IN_START_0_1 [get_bd_ports IN_START] [get_bd_pins CNTtest_0/IN_START]
connect_bd_net -net IN_CNTEN_0_1 [get_bd_ports IN_CNTEN] [get_bd_pins CNTtest_0/IN_CNTEN]
connect_bd_net [get_bd_pins CNTtest_0/SIGN_CNTC] [get_bd_pins ila_0/probe1]
connect_bd_net [get_bd_pins CNTtest_0/SIGN_CNTB] [get_bd_pins ila_0/probe7]
connect_bd_net [get_bd_pins CNTtest_0/SIGN_CNTA] [get_bd_pins ila_0/probe8]
connect_bd_net [get_bd_pins CNTtest_0/OUT_CNTEN] [get_bd_pins ila_0/probe9]
connect_bd_net [get_bd_pins CNTtest_0/OUT_START] [get_bd_pins ila_0/probe10]
connect_bd_net [get_bd_pins CNTtest_0/OUT_STOP] [get_bd_pins ila_0/probe11]
connect_bd_net [get_bd_pins CNTtest_0/OUT_CNTC] [get_bd_pins ila_0/probe12]
connect_bd_net [get_bd_pins rst_ps7_0_100M_1/peripheral_aresetn] [get_bd_pins CNTtest_0/sys_rst_n]
connect_bd_net [get_bd_pins CNTtest_0/OUT_CNTB] [get_bd_pins ila_0/probe13]
connect_bd_net [get_bd_pins CNTtest_0/OUT_CNTA] [get_bd_pins ila_0/probe14]
connect_bd_net -net IN_Correction_0_1 [get_bd_ports IN_Correction] [get_bd_pins MaxdataTrans_ip_0/IN_Correction]
connect_bd_net -net IN_spline1_0_1 [get_bd_ports IN_spline1] [get_bd_pins MaxdataTrans_ip_0/IN_spline1]
connect_bd_net -net IN_spline2_0_1 [get_bd_ports IN_spline2] [get_bd_pins MaxdataTrans_ip_0/IN_spline2]
connect_bd_net [get_bd_pins util_vector_logic_0/Res] [get_bd_pins count_ip_0/s0_axi_aresetn]
set_property HDL_ATTRIBUTE.DEBUG_IN_BD true [get_bd_nets ADS4249_Decode_0_daout]

# ---- address map ----
assign_bd_address -offset 0x00000000 -range 1G -target_address_space [get_bd_addr_spaces axi_dma_0/Data_MM2S] [get_bd_addr_segs processing_system7_0/S_AXI_HP0/HP0_DDR_LOWOCM]
assign_bd_address -offset 0x00000000 -range 1G -target_address_space [get_bd_addr_spaces axi_dma_0/Data_S2MM] [get_bd_addr_segs processing_system7_0/S_AXI_HP0/HP0_DDR_LOWOCM]
assign_bd_address -offset 0x40000000 -range 4K -target_address_space [get_bd_addr_spaces processing_system7_0/Data] [get_bd_addr_segs MaxdataTrans_ip_0/S0_AXI/S0_AXI_reg]
assign_bd_address -offset 0x40400000 -range 64K -target_address_space [get_bd_addr_spaces processing_system7_0/Data] [get_bd_addr_segs axi_dma_0/S_AXI_LITE/Reg]
assign_bd_address -offset 0x41200000 -range 4K -target_address_space [get_bd_addr_spaces processing_system7_0/Data] [get_bd_addr_segs axi_gpio_0/S_AXI/Reg]
assign_bd_address -offset 0x41220000 -range 4K -target_address_space [get_bd_addr_spaces processing_system7_0/Data] [get_bd_addr_segs axi_gpio_1/S_AXI/Reg]
assign_bd_address -offset 0x80000000 -range 64K -target_address_space [get_bd_addr_spaces processing_system7_0/Data] [get_bd_addr_segs count_ip_0/S0_AXI/S0_AXI_reg]

validate_bd_design
save_bd_design
